# EAGLE design sensorbug_v1 (EAGLE 8.2.1)
DATABASE: ../../Drive/agr_summer_2017/Eagle_BOM_DB
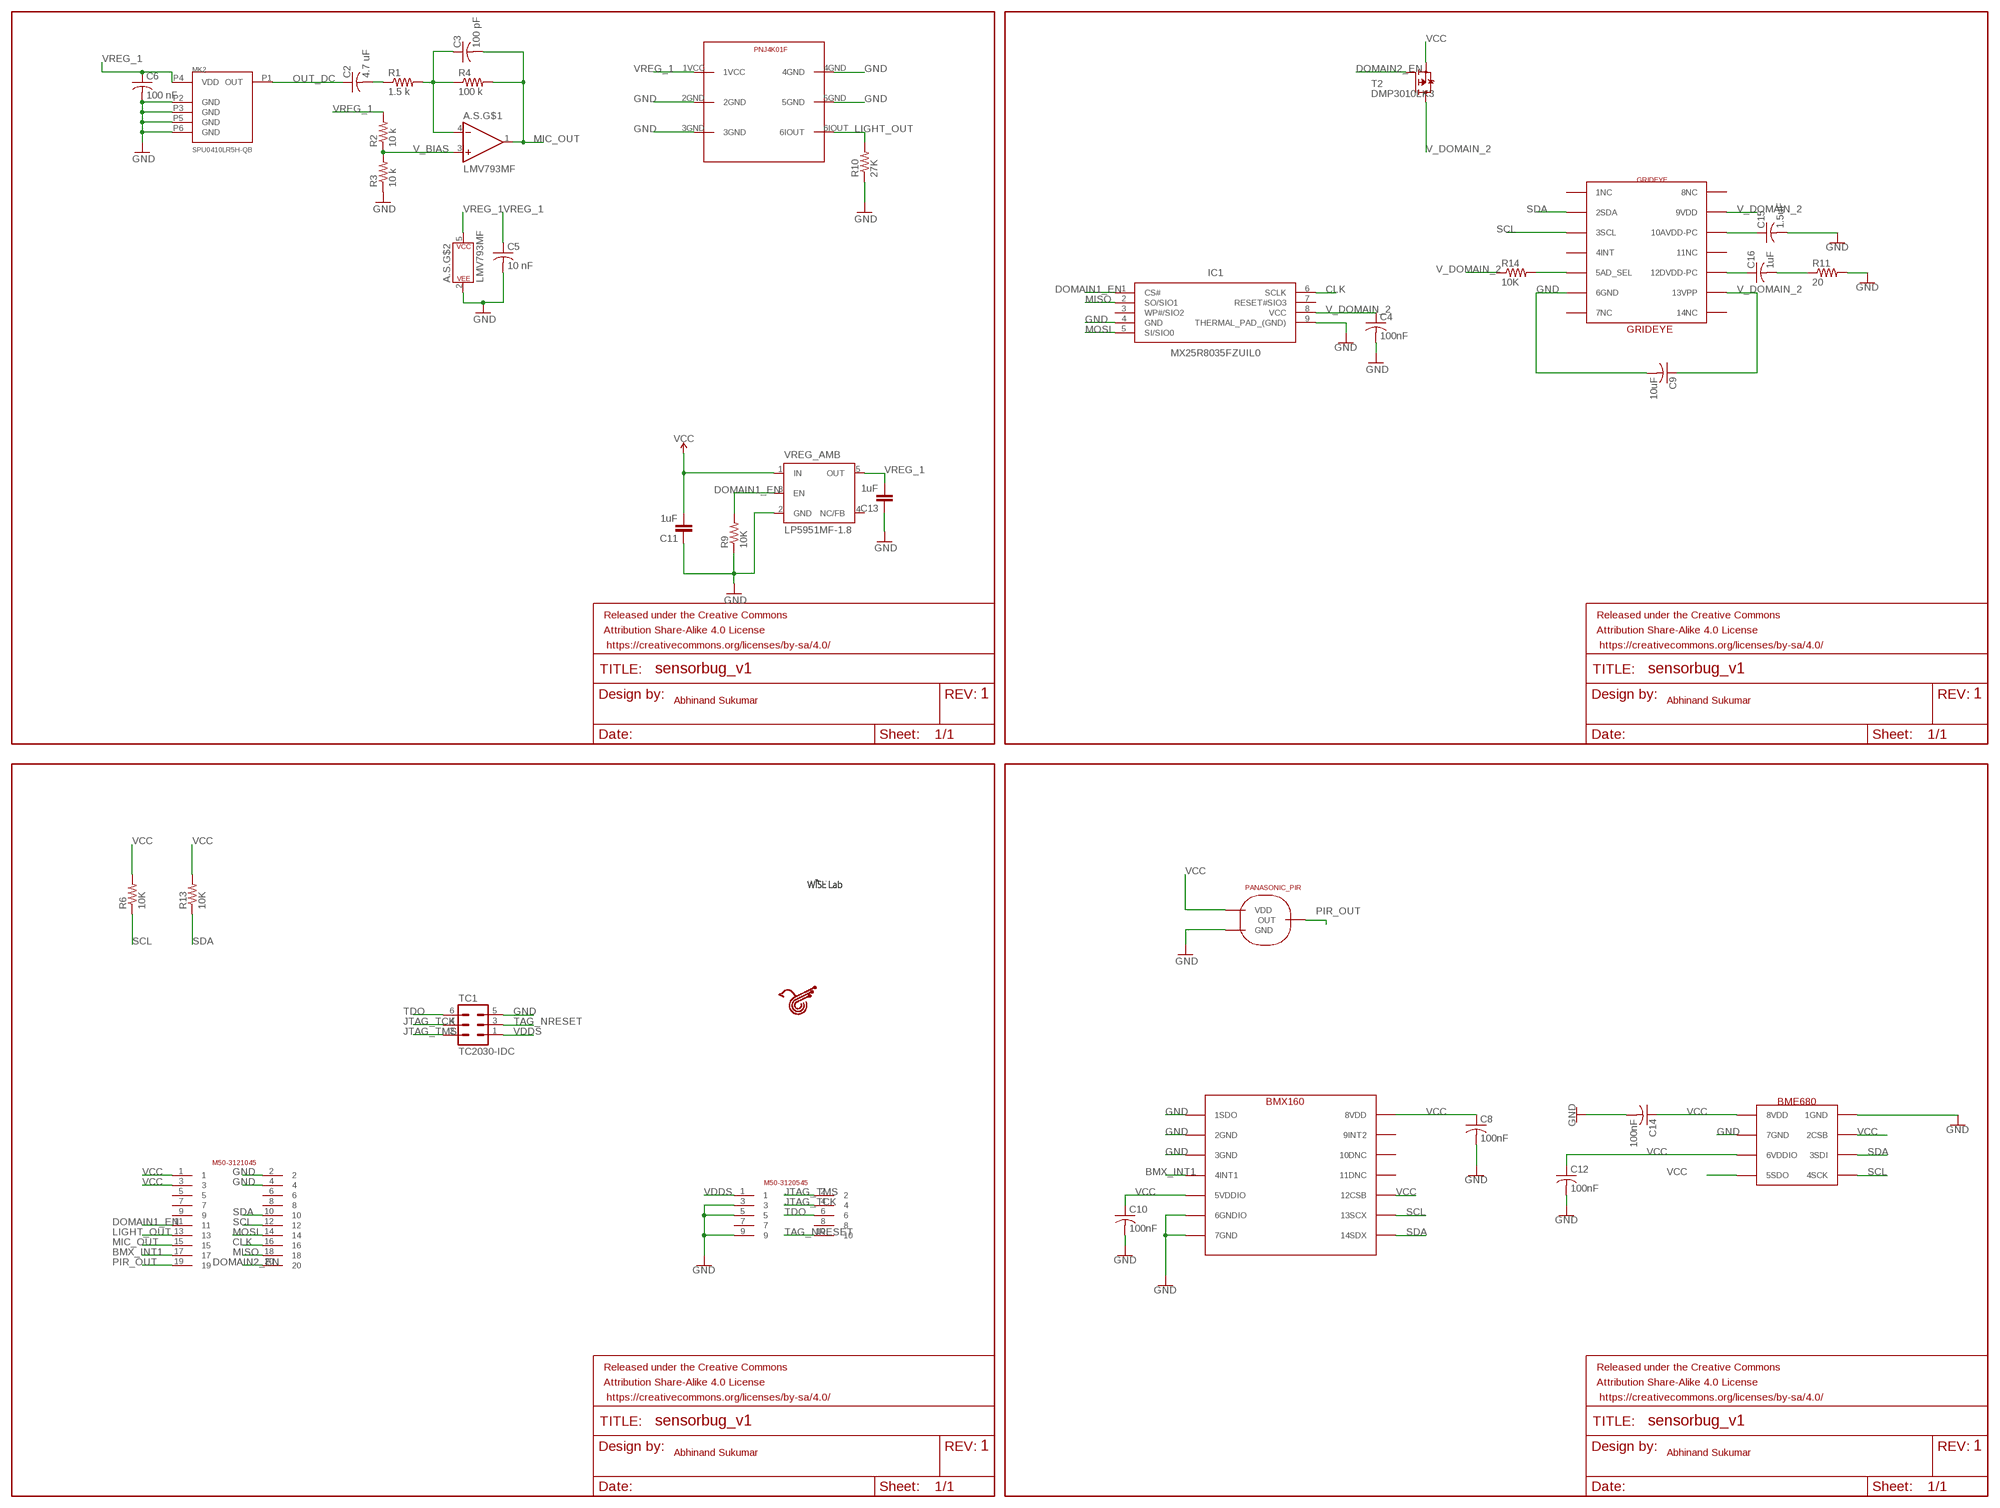
[diagram p0: schematic, sheet 1]

## Parts
A.S.  LMV793MF  [SOT23-5]
BME  BME680  [BME680_LGA]
BMX  BMX160  [LGA]
C2  4.7 uF  C-USC0603  [C0603]
C3  100 pF  C-USC0603  [C0603]
C4  100nF  C-USC0603  [C0603]
C5  10 nF  C-USC0603  [C0603]
C6  100 nF  C-USC0603  [C0603]
C8  100nF  C-USC0603  [C0603]
C9  10uF  C-USC0603  [C0603]
C10  100nF  C-USC0603  [C0603]
C11  1uF  C-EUC0603  [C0603]
C12  100nF  C-USC0603  [C0603]
C13  1uF  C-EUC0603  [C0603]
C14  100nF  C-USC0603  [C0603]
C15  1.5uF  C-USC0603  [C0603]
C16  1uF  C-USC0603  [C0603]
FRAME1  FRAME-LETTER  [CREATIVE_COMMONS]
FRAME2  FRAME-LETTER  [CREATIVE_COMMONS]
FRAME3  FRAME-LETTER  [CREATIVE_COMMONS]
FRAME4  FRAME-LETTER  [CREATIVE_COMMONS]
GRIDEYE  GRIDEYE  [GRIDEYE]
IC1  MX25R8035FZUIL0  [USON-8L]
LIGHT  PNJ4K01F  [PNJ4K01F]
MK2  SPU0410LR5H-QB  [SPU0410LR5H-QB]
R1  1.5 k  R-US_R0603  [R0603]
R2  10 k  R-US_R0603  [R0603]
R3  10 k  R-US_R0603  [R0603]
R4  100 k  R-US_R0603  [R0603]
R6  10K  R-US_R0603  [R0603]
R9  10K  R-US_R0603  [R0603]
R10  27K  R-US_R0603  [R0603]
R11  20  R-US_R0603  [R0603]
R13  10K  R-US_R0603  [R0603]
R14  10K  R-US_R0603  [R0603]
T2  DMP3010LK3  SPD30P06PTO252  [TO252]
TC1  TC2030-IDC  [TC2030-IDC]
U$2  WISELAB_LOGO-M  [WISELAB_LOGO_M]
U$3  EKMB1201112  [EKMB1201112]
U$4  M50-3121045  [M50-3121045]
U$5  M50-3120545  [M50-3100545]
U$6  OPENCHIR_LOGO_PCB-M  [OPENCHIRP_LOGO_M]
VREG_AMB  LP5951MF-1.8  [SOT23-DBV]

## Nets
BMX_INT1: BMX.4INT1 U$4.17
CLK: IC1.6(SCLK) U$4.16
DOMAIN1_EN: IC1.1(CS#) R9.2 U$4.11 VREG_AMB.3(EN)
DOMAIN2_EN: T2.1(G) U$4.20
GND: A.S..2(P$V-) BME.1GND BME.7GND BMX.1SDO BMX.2GND BMX.3GND BMX.6GNDIO BMX.7GND C4.2 C5.2 C6.2 C8.2 C9.2 C10.2 C11.1 C12.2 C13.1 C14.2 C15.2 GRIDEYE.6(6GND) IC1.4(GND) IC1.9(THERMAL_PAD_(GND)) LIGHT.2GND LIGHT.3GND LIGHT.4GND LIGHT.5GND MK2.P2(GND) MK2.P3(GND) MK2.P5(GND) MK2.P6(GND) R3.1 R9.1 R10.1 R11.2 TC1.5 U$3.GND U$4.2 U$4.4 U$5.3 U$5.5 U$5.9 VREG_AMB.2(GND)
JTAG_TCK: TC1.4 U$5.4
JTAG_TMS: TC1.2 U$5.2
LIGHT_OUT: LIGHT.6IOUT R10.2 U$4.13
MIC_OUT: A.S..1(OUT) C3.2 R4.2 U$4.15
MISO: IC1.2(SO/SIO1) U$4.18
MOSI: IC1.5(SI/SIO0) U$4.14
N$2: C15.1 GRIDEYE.10(10AVDD-PC)
N$3: A.S..4(-IN) C3.1 R1.2 R4.1
N$4: C16.1 GRIDEYE.12(12DVDD-PC)
N$5: GRIDEYE.5(5AD_SEL) R14.2
N$6: C16.2 R11.1
OUT_AC: C2.2 R1.1
OUT_DC: C2.1 MK2.P1(OUT)
PIR_OUT: U$3.OUT U$4.19
SCL: BME.4SCK BMX.13SCX GRIDEYE.3(3SCL) R6.1 U$4.12
SDA: BME.3SDI BMX.14SDX GRIDEYE.2(2SDA) R13.1 U$4.10
TAG_NRESET: TC1.3 U$5.10
TDO: TC1.6 U$5.6
V_BIAS: A.S..3(+IN) R2.1 R3.2
V_DOMAIN_2: C4.1 C9.1 GRIDEYE.9(9VDD) GRIDEYE.13(13VPP) IC1.8(VCC) R14.1 T2.3(D)
VCC: BME.2CSB BME.5SDO BME.6VDDIO BME.8VDD BMX.5VDDIO BMX.8VDD BMX.12CSB C8.1 C10.1 C11.2 C12.1 C14.1 R6.2 R13.2 T2.2(S) U$3.VDD U$4.1 U$4.3 VREG_AMB.1(IN)
VDDS: TC1.1 U$5.1
VREG_1: A.S..5(P$V+) C5.1 C6.1 C13.2 LIGHT.1VCC MK2.P4(VDD) R2.2 VREG_AMB.5(OUT)
Unconnected: BMX.9INT2 BMX.10DNC BMX.11DNC GRIDEYE.1(1NC) GRIDEYE.4(4INT) GRIDEYE.7(7NC) GRIDEYE.8(8NC) GRIDEYE.11(11NC) GRIDEYE.14(14NC) IC1.3(WP#/SIO2) IC1.7(RESET#SIO3) U$4.5 U$4.6 U$4.7 U$4.8 U$4.9 U$5.7 U$5.8 VREG_AMB.4(NC/FB)

## Library data of the parts
A.S. = Audio_Board_Parts:LMV793: Texas Instruments Low Noise, 88 MHz GBP, 1.8 V CMOS Input Decompensated Operational Amplifiers
BME = BME680:BME680
BMX = bmx160:BMX160
C2-C6 C8-C10 C12 C14-C16 = rcl:C-US: CAPACITOR, American symbol
C11 C13 = rcl:C-EU: CAPACITOR, European symbol
FRAME1-FRAME4 = SparkFun-Aesthetics:FRAME-LETTER: Schematic Frame - Letter Standard 8.5x11 US Letter frame
GRIDEYE = GRIDEYE:GRIDEYE
IC1 = MX25R8035FZUIL0:MX25R8035FZUIL0: ULTRA LOW POWER, 8M-BIT [x 1/x 2/x 4] CMOS MXSMIO (SERIAL MULTI I/O) FLASH MEMORY, USON-8L <https://componentsearchengine.com/Images/9/MX25R8035FZUIL0.jpg> Source: Datasheet <http://www.macronix.com/Lists/Datasheet/Attachments/5097/MX25R8035F, Wide Range, 8Mb, v1.3.pdf>; DESCRIPTION: ULTRA LOW POWER, 8M-BIT [x 1/x 2/x 4] CMOS MXSMIO (SERIAL MULTI I/O) FLASH MEMORY, USON-8L; HEIGHT: mm; MANUFACTURER_NAME: Macronix; MANUFACTURER_PART_NUMBER: MX25R8035FZUIL0
LIGHT = PNJ4K01F:PNJ4K01F
MK2 = Audio_Board_Parts:SPU0410: Knowles Zero-Height SiSonic Microphone
R1-R4 R6 R9-R11 R13 R14 = rcl:R-US_: RESISTOR, American symbol
T2 = transistor-fet:SPD30P06P: SIPMOS(R) Power-Transistor P-Channel, Enhancement mode Source: http://www.infineon.com/upload/Document/cmc_upload/documents/012/3615/SPD_U30P06P.pdf
TC1 = TagConnect:TC2030-IDC: Tag-Connect In Circuit Programming & Debug Cable 6 Pin http://www.tag-connect.com
U$2 = frames:WISELAB_LOGO
U$3 = EKMB1201112:EKMB1201112
U$4 = M50-3121045:M50-3121045
U$5 = M50-3120545:M50-3120545
U$6 = frames:OPENCHIR_LOGO_PCB
VREG_AMB = texas:LP5951MF-1.8

## Board
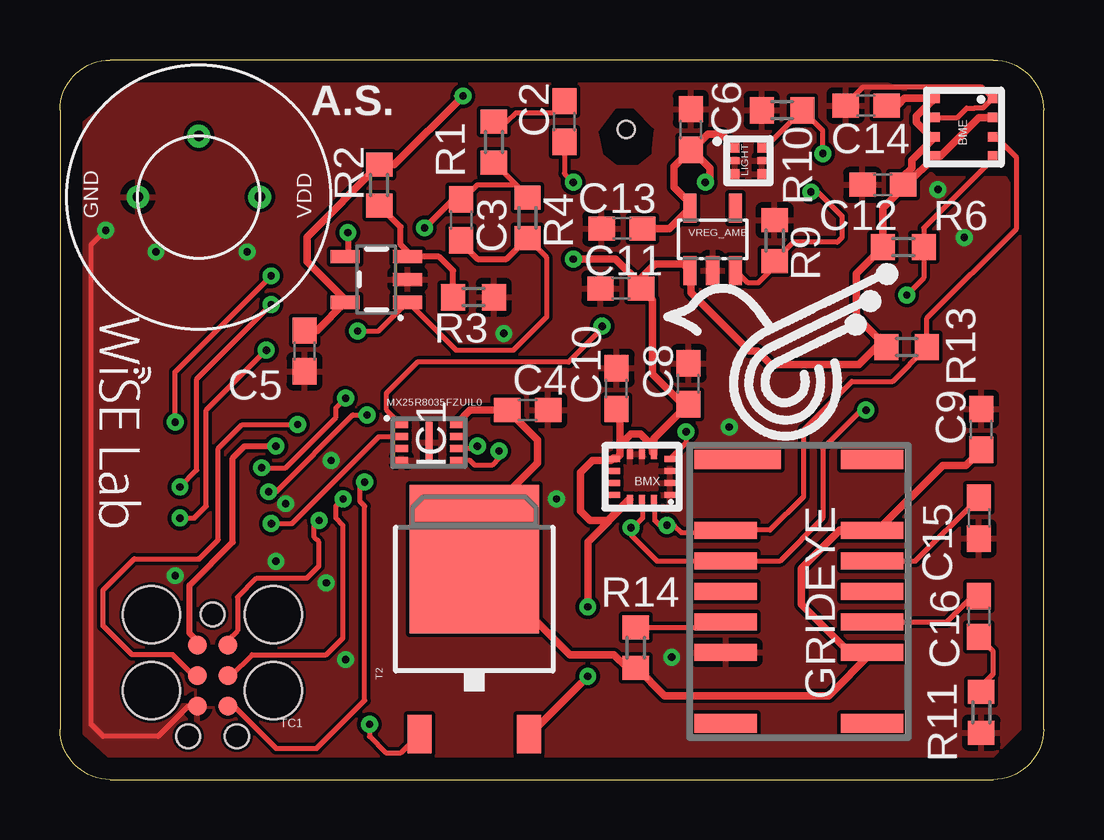
[diagram p1: board, top side]
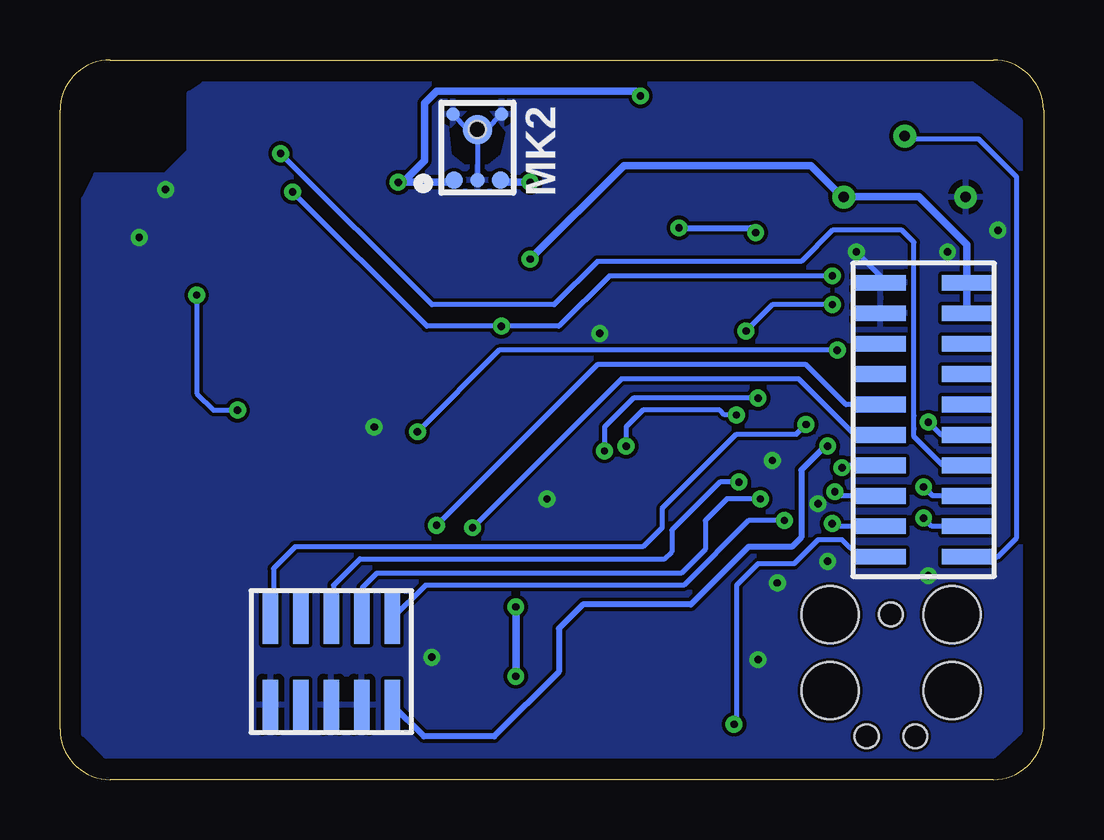
[diagram p2: board, bottom side, seen from below]

Size 41 x 30 mm. Coordinates in mm from the lower left corner, seen from the top.
Outline: 2.1,0 38.9,0 arc90 41,2.1 41,27.9 arc90 38.9,30 2.1,30 arc90 0,27.9 0,2.1 arc90 2.1,0
Copper layers (1*16): Top 0.035mm / dielectric 1.5mm / Bottom 0.035mm
Design rules "default *": minimum track width 6mil, minimum drill 0.3mm, track to track 6mil, track to pad 6mil, pad to pad 6mil, via to via 6mil, smd to smd 6mil, copper to edge 6mil, drill to drill 6mil, minimum pad ring 10mil, minimum via ring 8mil, stop-mask expansion 4mil, vias tented up to drill 0mil, thermal gap 10mil

### Footprints (pad centres in the part's own frame; a part is rotated, then mirrored left to right if it is on the bottom)
SOT23-5 = smd 0.55 x 1.2: 1 -0.95,-1.3; 2 0,-1.3; 3 0.95,-1.3; 4 0.95,1.3; 5 -0.95,1.3
BME680_LGA = smd 0.4 x 0.4: 1GND 1.2,1.2; 2CSB 1.2,0.4; 3SDI 1.2,-0.4; 4SCK 1.2,-1.2; 5SDO -1.2,-1.2; 6VDDIO -1.2,-0.4; 7GND -1.2,0.4; 8VDD -1.2,1.2
LGA = smd 0.475 x 0.25: 1SDO -1.165,0.75; 2GND -1.165,0.25; 3GND -1.165,-0.25; 4INT1 -1.165,-0.75; 8VDD 1.165,-0.75; 9INT2 1.165,-0.25; 10DNC 1.165,0.25; 11DNC 1.165,0.75 | smd 0.25 x 0.4: 5VDDIO -0.5,-0.95; 6GNDIO 0,-0.95; 7GND 0.5,-0.95; 12CSB 0.5,0.95; 13SCX 0,0.95; 14SDX -0.5,0.95
C0603 = smd 1.1 x 1: 1 -0.85,0; 2 0.85,0
GRIDEYE = smd 0.8 x 3.6: 1 -5.5,-2.55 | smd 0.7 x 2.6: 2 -2.54,-3.05; 3 -1.27,-3.05; 4 0,-3.05; 5 1.27,-3.05; 6 2.54,-3.05; 9 -2.54,3.05; 10 -1.27,3.05; 11 0,3.05; 12 1.27,3.05; 13 2.54,3.05 | smd 0.8 x 2.6: 7 5.5,-3.05; 8 -5.5,3.05; 14 5.5,3.05
USON-8L = smd 0.3 x 0.55: 1 -0.75,-1.15; 2 -0.25,-1.15; 3 0.25,-1.15; 4 0.75,-1.15; 5 0.75,1.15; 6 0.25,1.15; 7 -0.25,1.15; 8 -0.75,1.15 | smd 1.7 x 0.3: 9 0,0
PNJ4K01F = smd 0.37 x 0.43: 1VCC -0.565,0.56; 3GND -0.565,-0.56; 4GND 0.565,-0.56; 6IOUT 0.565,0.56 | smd 0.37 x 0.3: 2GND -0.565,0; 5GND 0.565,0
SPU0410LR5H-QB = smd 0.723 x 0.723: P1 -0.966,2.103; P4 0.966,2.103 | smd 0.562 x 0.562: P2 -1.015,-0.634; P3 1.015,-0.634 | smd 0.612 x 0.612: P5 0,2.103 | smd 1.224 x 1.224: P6 0,0 | hole 0.7: 0,0
R0603 = smd 1 x 1.1: 1 -0.85,0; 2 0.85,0
TO252 = smd 1 x 1.6: 1 -2.28,-4.8; 2 2.28,-4.8 | smd 5.4 x 6.2: 3 0,2.5
TC2030-IDC = smd 0.787 x 0.787: 1 -1.27,-0.635; 2 -1.27,0.635; 3 0,-0.635; 4 0,0.635; 5 1.27,-0.635; 6 1.27,0.635 | hole 0.991: -2.54,0; 2.54,1.016; 2.54,-1.016 | hole 2.375: -2.54,2.54; -2.54,-2.54; 0.635,2.54; 0.635,-2.54
EKMB1201112 = drill 0.45: GND 0,2.54; OUT 2.54,0; VDD 0,-2.54
M50-3121045 = smd 0.65 x 2.1 bottom: 1 -5.715,-1.8; 2 -5.715,1.8; 3 -4.445,-1.8; 4 -4.445,1.8; 5 -3.175,-1.8; 6 -3.175,1.8; 7 -1.905,-1.8; 8 -1.905,1.8; 9 -0.635,-1.8; 10 -0.635,1.8; 11 0.635,-1.8; 12 0.635,1.8; 13 1.905,-1.8; 14 1.905,1.8; 15 3.175,-1.8; 16 3.175,1.8; 17 4.445,-1.8; 18 4.445,1.8; 19 5.715,-1.8; 20 5.715,1.8
M50-3100545 = smd 0.65 x 2.1 bottom: 1 -2.54,-1.8; 2 -2.54,1.8; 3 -1.27,-1.8; 4 -1.27,1.8; 5 0,-1.8; 6 0,1.8; 7 1.27,-1.8; 8 1.27,1.8; 9 2.54,-1.8; 10 2.54,1.8
SOT23-DBV = smd 0.55 x 1.2: 1 -0.95,-1.3; 2 0,-1.3; 3 0.95,-1.3; 4 0.95,1.3; 5 -0.95,1.3

### Placement (x,y rotation side)
A.S.  13.19,20.85 90 top
BME  37.68,27.2 0 top
BMX  24.27,12.62 180 top
C2  21.03,27.43 90 top
C3  16.72,23.33 270 top
C4  19.5,15.4 0 top
C5  10.19,17.87 270 top
C6  26.3,27.1 90 top
C8  26.2,16.5 90 top
C9  38.4,14.6 90 top
C10  23.2,16.3 90 top
C11  23.38,20.47 0 top
C12  34.3,24.8 180 top
C13  23.43,22.97 0 top
C14  33.6,28.1 180 top
C15  38.3,10.9 270 top
C16  38.3,6.8 270 top
FRAME1  21.59,-49.53 0 top  (outside the outline)
FRAME2  16.51,-109.22 0 top  (outside the outline)
FRAME3  16.51,-293.37 0 top  (outside the outline)
FRAME4  16.51,-302.26 0 top  (outside the outline)
GRIDEYE  30.8,7.84 270 top
IC1  15.38,14.05 270 top
LIGHT  28.7,25.8 0 top
MK2  23.6,27.1 180 bottom
R1  18.09,26.57 270 top
R2  13.31,24.78 90 top
R3  17.24,20.11 180 top
R4  19.49,23.42 270 top
R6  35.16,22.2 180 top
R9  29.79,22.47 270 top
R10  30.1,27.9 0 top
R11  38.4,2.8 270 top
R13  35.29,18.03 180 top
R14  24,5.5 90 top
T2  17.27,6.69 0 top
TC1  6.36,4.34 270 top
U$2  2.5,15 270 top
U$3  5.79,24.29 90 top
U$4  5,15 270 top
U$5  29.69,4.92 0 top
U$6  29.1,16.6 0 top
VREG_AMB  27.21,22.52 0 top

### Tracks (layer width: path | path; a pad name or v marks a point on that pad's centre or on a via)
BMX_INT1  (via drill 0.3)
  Top 0.203: v5,10.9 5.6,10.9 6.1,11.4 6.1,15.4 v8.6,17.9 | v26.1,14.5 26.1,14.04 BMX.4INT1
  Bottom 0.203: U$4.17 4.66,10.55 v5,10.9 | v8.6,17.9 22.7,17.9 v26.1,14.5
CLK  (via drill 0.3)
  Top 0.203: v17.4,13.9 17.2,13.9 17.1,13.8 IC1.6 | v8.7,12 9,12 12.2,15.2 v12.8,15.2
  Bottom 0.203: U$4.16 8.53,11.82 v8.7,12 | v12.8,15.2 13.3,15.2 13.5,15.4 16.7,15.4 17.4,14.7 v17.4,13.9
DOMAIN1_EN  (via drill 0.3)
  Top 0.203: VREG_AMB.3 28.68,20.7 29.1,20.7 29.79,21.39 R9.2 30.57,22.4 32.4,22.4 32.6,22.6 32.6,23.5 31.6,24.5 v31.3,24.5 | v22.6,18.9 22.6,18.8 21.2,17.4 14.9,17.4 13.6,16.1 13.6,15.43 IC1.1 | v4.8,14.9 4.8,17 v8.8,21
  Bottom 0.203: v8.8,21 18.1,21 20.2,18.9 v22.6,18.9 25.7,18.9 v31.3,24.5 | U$4.11 4.26,14.37 v4.8,14.9
DOMAIN2_EN  (via drill 0.3)
  Top 0.203: v12.9,2.3 12.9,1.8 13.58,1.12 14.22,1.12 T2.1
  Bottom 0.203: U$4.20 7.68,9.29 8.4,10 9.4,10 10.4,9 11.9,9 12.8,8.1 12.8,3.3 12.8,2.4 v12.9,2.3
GND  (via drill 0.3)
  Top 0.203: TC1.5 5.72,2.98 | 32.9,28.1 C14.2 32.75,28.15 33.48,28.88 38.4,28.88 BME.1GND 38.49,28.01 38.13,28.01 38.12,28 37.8,28 37.4,27.6 BME.7GND | TC1.5 5.58,3.07 | TC1.5 5.57,3.07 | v1.9,22.9 1.3,22.3 1.3,2.3 1.8,1.8 4.1,1.8 5.37,3.07 TC1.5
  Top 0.254: 5.72,2.88 TC1.5
  Bottom 0.203: U$4.2 6.8,21 v7.8,22 | MK2.P6 23.98,27.1 MK2.P3 | MK2.P6 23.22,27.1 MK2.P2 | MK2.P6 MK2.P5
  other vias: 18.5,18.6 27.9,14.7 25.5,5.1 37.7,22.6 36.6,24.6 11.9,5 11.1,8.2 9,9.1 4.8,8.5 4,22 20.7,11.7 11.3,13.3 9.4,11.5
  pour Top: 1,27.4 1,1.9 2,1 38.9,1 40,2.1 40,24.1 39.4,25.1 36.5,25.1 35.4,26.2 35.4,28.7 34.5,29 3,29
  pour Bottom: 1,27.5 1,2 2.1,1 39.1,1 40,1.9 40,24.2 39.5,25.2 36.6,25.2 35.6,26.2 35.6,28.6 35,29 3,29
JTAG_TCK  (via drill 0.3)
  Top 0.203: TC1.4 7.14,4.34 8,5.2 11.1,5.2 11.8,5.9 11.8,10.6 11.5,10.9 11.5,11.4 v11.8,11.7
  Bottom 0.203: U$5.4 28.4,6.74 28.4,8 27.8,8.6 15.1,8.6 14.1,9.6 14.1,10.8 13.2,11.7 v11.8,11.7
JTAG_TMS  (via drill 0.3)
  Top 0.203: 7,5.89 TC1.2 7,5.79 7.4,6.2 7.4,7.6 8.2,8.4 10.3,8.4 10.8,8.9 10.8,9.9 10.6,10.1 10.6,10.6 v10.8,10.8
  Bottom 0.203: U$5.2 25.77,8.1 15,8.1 12.3,10.8 v10.8,10.8
LIGHT_OUT  (via drill 0.3)
  Top 0.203: v31.8,26.1 31.8,27.05 R10.2 29.41,26.36 LIGHT.6IOUT
  Bottom 0.203: v31.8,26.1 25.5,19.8 20.4,19.8 18.6,21.6 10.1,21.6 8.8,22.9 5.9,22.9 5.4,22.4 5.4,15.16 5.41,15.15 5.41,14.65 | U$4.13 4.2,13.1 5.4,14.3 5.4,14.6 | 5.4,14.6 5.4,14.64 | 5.4,14.64 5.41,14.65 | 5.4,14.6 5.4,14.64 | 5.4,14.64 5.41,14.65
MIC_OUT  (via drill 0.3)
  Top 0.203: 19.49,22.51 R4.2 20.3,21.76 20.3,19.3 18.9,17.9 16.5,17.9 A.S..1 13.29,18.7 v12.4,18.7 | v5,12.2 5.7,12.9 5.7,16.7 v8.8,19.8
  Top 0.254: C3.2 16.72,22.38 17.4,21.7 18.62,21.7 R4.2
  Bottom 0.203: U$4.15 4.62,11.82 v5,12.2 | v8.8,19.8 11.3,19.8 v12.4,18.7
MISO  (via drill 0.3)
  Top 0.203: v8.81,10.67 9.67,10.67 13.3,14.3 IC1.2
  Bottom 0.203: U$4.18 8.7,10.55 v8.81,10.67
MOSI  (via drill 0.3)
  Top 0.203: v8.4,13 9.4,13 11.5,15.1 11.5,15.5 v11.9,15.9 | v18.3,13.7 18.3,13.4 18,13.1 17.3,13.1 17.1,13.3 IC1.5
  Bottom 0.203: U$4.14 8.3,13.1 v8.4,13 | v11.9,15.9 17.1,15.9 18.3,14.7 v18.3,13.7
N$1
  cutout Bottom: 22.5,27 22.7,26.1 23.2,25.7 24.1,25.7 24.6,26.1 24.7,27.1 23.9,27.9 23.2,27.9
N$2
  Top 0.203: 38.3,11.7 C15.1 35.66,9.11 GRIDEYE.10
N$3  (via drill 0.3)
  Top 0.203: 16.78,24.18 17.4,24.8 18.96,24.8 R4.1 19.49,24.32 R1.2
  Top 0.254: 16.78,24.18 C3.1 16.38,24.18 v15.2,23 | v12,22.8 12,21.91 A.S..4
  Bottom 0.254: v15.2,23 12.2,23 v12,22.8
N$4
  Top 0.203: C16.1 38.05,7.65 36.97,6.57 GRIDEYE.12
N$5
  Top 0.203: R14.2 27.53,6.35 GRIDEYE.5
N$6
  Top 0.203: R11.1 38.4,3.9 38.9,4.4 38.9,5.35 C16.2
N$7
  cutout Top: 22.5,27 22.7,26.1 23.2,25.7 24.1,25.7 24.6,26.1 24.7,27.1 23.9,27.9 23.2,27.9
OUT_AC
  Top 0.203: R1.1 18.62,27.42 19,27.8 20.55,27.8 C2.2
OUT_DC  (via drill 0.3)
  Top 0.203: C2.1 21.03,25.27 v21.4,24.9
  Bottom 0.203: v21.4,24.9
  Bottom 0.305: v21.4,24.9 22.54,24.9 MK2.P1
PIR_OUT
  Bottom 0.203: U$4.19 1.92,9.29 1.12,10.08 1.12,25.12 1.9,25.9 | 1.9,25.9 2,26 | 1.9,25.9 2.7,26.7 5.66,26.7 U$3.OUT
SCL  (via drill 0.3)
  Top 0.203: BME.4SCK 38.88,25.87 36.01,23 R6.1 36.01,20.91 v35.3,20.2 | BMX.13SCX 24.3,11.63 24.3,10.9 23.9,10.5 v23.8,10.5 23.8,10.2 24.9,9.1 GRIDEYE.3 | GRIDEYE.3 | v33.6,15.4 33.4,15.4 31.8,13.8 31.8,10.9 30,9.1 GRIDEYE.3
  Bottom 0.203: U$4.12 7.87,14.37 10.2,16.7 17.6,16.7 v23.8,10.5 | v35.3,20.2 35.3,16.1 34.6,15.4 v33.6,15.4
SDA  (via drill 0.3)
  Top 0.203: 38.9,26.8 BME.3SDI | BME.3SDI 38.88,26.76 | BME.3SDI 39,26.8 39.88,25.92 39.88,22.97 36.14,19.23 R13.1 34.71,16.6 33,16.6 31,14.6 31,11.8 29.6,10.4 27.77,10.4 GRIDEYE.2 27.67,10.3 25.9,10.3 25.6,10.6 v25.3,10.6 25,10.6 24.8,10.8 24.8,11.63 BMX.14SDX
  Bottom 0.203: U$4.10 8.23,15.63 9.9,17.3 18.6,17.3 v25.3,10.6
TAG_NRESET  (via drill 0.3)
  Top 0.203: 5.56,4.34 4.7,5.2 3,5.2 1.8,6.4 1.8,7.9 3.1,9.2 5.77,9.2 5.79,9.19 6.6,10 6.6,13.8 7.6,14.8 v9.9,14.8
  Top 0.254: TC1.3 5.56,4.34
  Bottom 0.203: U$5.10 32.1,6.84 32.1,8.8 31.2,9.7 16.7,9.7 15.9,10.5 15.9,11.3 12.8,14.4 10.3,14.4 v9.9,14.8
TDO  (via drill 0.3)
  Top 0.203: TC1.6 7.23,3.07 9,1.3 10.7,1.3 12.7,3.3 12.7,11.4 12.5,11.6 12.5,12.2 v12.7,12.4
  Bottom 0.203: U$5.6 29.6,6.8 29.6,8.1 28.5,9.2 15.8,9.2 15.5,9.5 15.5,10.4 13.5,12.4 v12.7,12.4
V_BIAS
  Top 0.254: R3.2 16.39,21.21 15.8,21.8 A.S..3 14.49,22.01 14.2,22.3 14.2,23.04 R2.1
V_DOMAIN_2
  Top 0.203: GRIDEYE.13 33.5,5.3
  Top 0.254: 32.9,5.3 GRIDEYE.13 | 34.08,10.38 GRIDEYE.9 33.83,10.4 | 24.05,4.65 R14.1 | R14.1 23.75,4.65 | R14.1 23.65,4.65 | T2.3 17.27,10.02
  Top 0.305: 32.9,5.3 30.9,7.3 30.9,8.8 32.5,10.4 33.83,10.4 | 34.08,10.38 36.8,13.1 37.75,13.1 C9.1 | 24.05,4.65 25.2,3.5 32.05,3.5 GRIDEYE.13 | 23.65,4.65 23.1,5.2 21.26,5.2 T2.3 17.27,10.57 19.9,13.2 19.9,14.15 C4.1 17.1,15.4 16.53,14.83 IC1.8
VCC  (via drill 0.3)
  Top 0.254: C14.1 34.7,28.1 34.4,27.8 | BMX.12CSB 23.67,11.67 22.8,10.8 | T2.2 19.59,1.89 | C11.2 24.23,20.63 | VREG_AMB.1 26.18,21.3 | 35.28,24.8 C12.1 | BME.6VDDIO 36.4,26.8
  Top 0.305: 22.8,10.8 22.1,10.8 21.7,11.2 21.7,12.8 22.2,13.3 22.97,13.3 | 19.59,1.89 v22,4.3 | v22,7.2 22,9.9 BMX.12CSB | C12.1 35.15,25.15 35.5,25.5 35.5,25.82 BME.6VDDIO 36.3,26.8 35.7,27.4 35.7,27.65 36.15,28.11 36.19,28.11 BME.8VDD 35.2,28.4 34.9,28.1 C14.1 | v21.4,21.7 23.16,21.7 24.23,20.63 | BME.2CSB 38.3,27.6 36.7,26 BME.5SDO 35.28,24.8 34.31,23.83 R6.2 33.2,21.09 33.2,19.3 34.44,18.06 R13.2 34.03,18.03 33.3,17.3 29.63,17.3 29.07,17.86 28.74,17.86 26.3,20.3 26.3,21.18 VREG_AMB.1 25.98,21.5 24.8,21.5 24.23,20.93 C11.2 24.7,20 24.7,16.9 25.95,15.65 C8.1 24.77,14.21 BMX.5VDDIO | 23.34,13.54 23.17,13.37 BMX.8VDD 23.07,13.4 22.97,13.3 | 23.34,13.54 23.34,15.31 C10.1 | BMX.5VDDIO 24.77,13.83 | 22.97,13.3 | 23.34,13.54 23.34,13.94 23.8,14.4 24.19,14.4 24.7,13.9 24.7,13.64 BMX.5VDDIO
  Bottom 0.305: v22,4.3 v22,7.2 | U$4.3 U$4.1 | U$4.1 3.2,20.9 | v21.4,21.7 17.5,25.6 9.7,25.6 8.39,24.29 U$3.VDD 5.2,24.3 3.2,22.3 U$4.1
VDDS  (via drill 0.3)
  Top 0.254: TC1.1 5.72,5.78 5.4,6.1 5.4,8.1 7.2,9.9 7.2,13.4 7.7,13.9 v9,13.9
  Bottom 0.254: 9.1,13.9 v9,13.9 9.1,13.9 | U$5.1 25.83,1.8 22.9,1.8 20.2,4.5 20.2,6.3 19.2,7.3 14.7,7.3 12.3,9.7 10.5,9.7 10.1,10.1 10.1,12.9 9.1,13.9
VREG_1  (via drill 0.3)
  Top 0.254: 13.33,25.63 R2.2 | C5.1 10.71,18.72 | A.S..5 11.89,20.01 | 26.26,23.84 VREG_AMB.5 | v16.8,28.5 16.55,28.5
  Top 0.305: 10.71,18.72 A.S..5 | 11.89,20.01 10.3,21.6 10.3,22.62 R2.2 | 13.68,25.63 R2.2 | C13.2 25.41,22.97 VREG_AMB.5 26.26,24.04 25.6,24.7 25.6,25.55 C6.1 26.35,26.25 | R2.2 13.93,25.63 v16.8,28.5 | 26.35,26.25 27,26.9 27.59,26.9 LIGHT.1VCC | 26.35,26.25 27.1,25.5 27.1,25.1 v26.9,24.9
  Bottom 0.305: v16.8,28.5 17,28.7 25.3,28.7 25.8,28.2 25.8,25.8 26.7,24.9 v26.9,24.9 24.66,24.9 MK2.P4